# EAGLE design WC_Lower (EAGLE 9.6.2)
VERSION: 2.0

## Sheet 1 of 2: Power and B2B
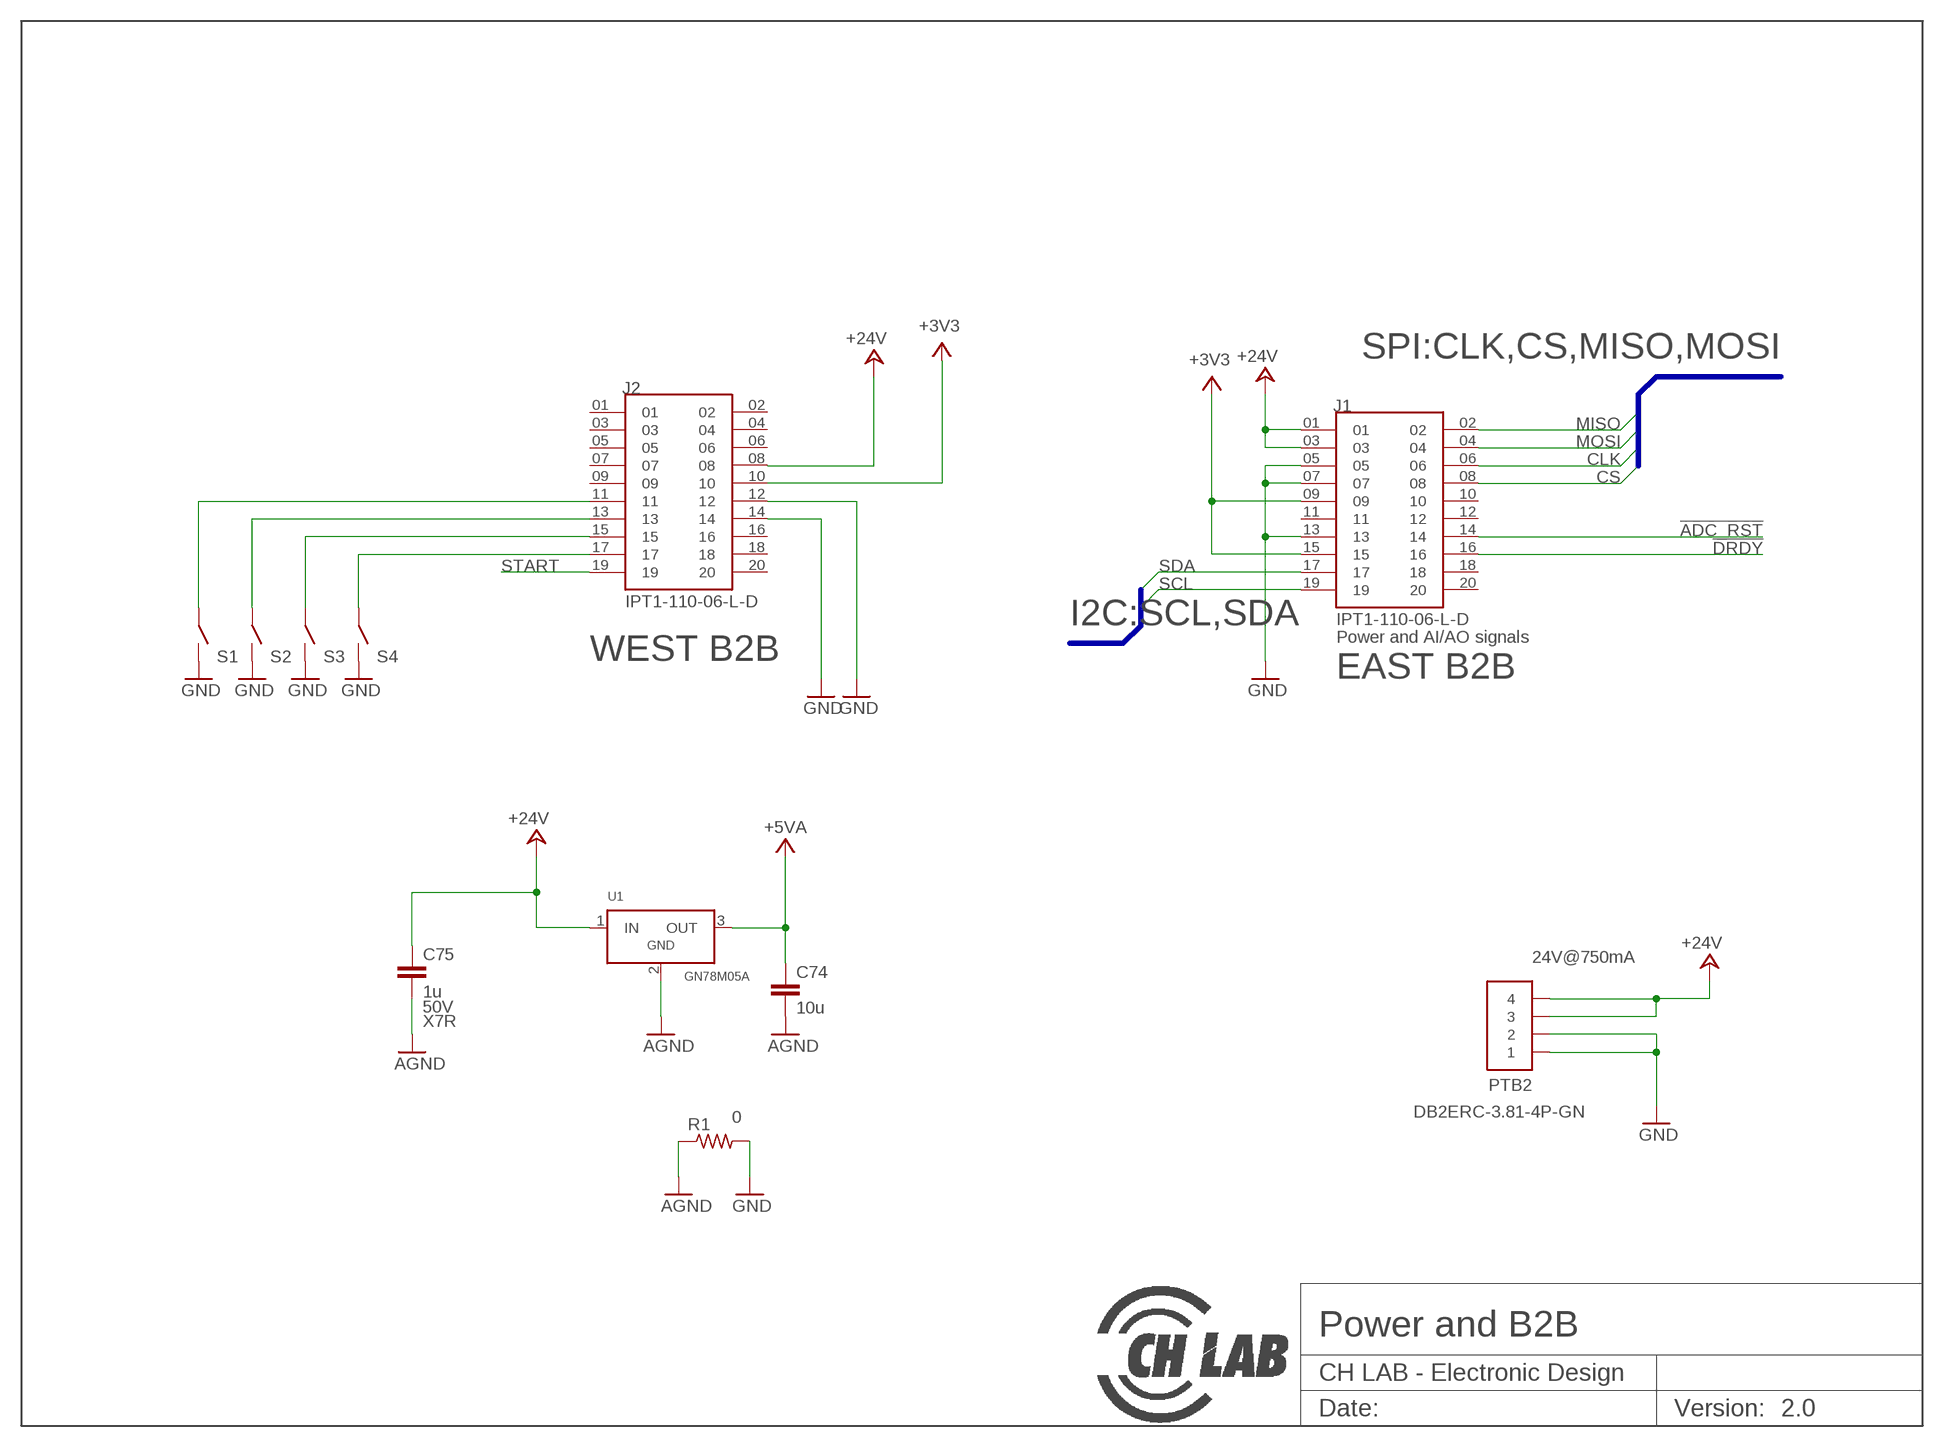
[diagram p0: schematic, sheet 1]

### Parts
C74  10u  C_0805  [C_0805]
C75  1u  C_1206  [C_1206]
J1  IPT1-110-06-L-D  [SAMTEC_IPT1-110-06-L-D]
J2  IPT1-110-06-L-D  [SAMTEC_IPT1-110-06-L-D]
PTB2  DB2ERC-3.81-4P-GN  PLUGTB-4-1803293  [1803293]
R1  0  R_0603  [R_0603]
S1  TSWITCH_SMTR2  [SMTR2]
S2  TSWITCH_SMTR2  [SMTR2]
S3  TSWITCH_SMTR2  [SMTR2]
S4  TSWITCH_SMTR2  [SMTR2]
U1  GN78M05A  [TO-252]

### Nets
!ADC_RST!: J1.14 ; also sheet 2
!DRDY!: J1.16 ; also sheet 2
+3V3: J1.09 J1.15 J2.10 ; also sheet 2
+5VA: C74.P$1 U1.3(OUT) ; also sheet 2
+24V: C75.P$1 J1.01 J1.03 J2.08 PTB2.P$3 PTB2.P$4 U1.1(IN)
AGND: C74.P$2 C75.P$2 R1.1 U1.2(GND) ; also sheet 2
CLK: J1.06 ; also sheet 2
CS: J1.08 ; also sheet 2
GND: J1.05 J1.07 J1.13 J2.12 J2.14 PTB2.P$1 PTB2.P$2 R1.2 S1.P$3 S1.P$4 S2.P$3 S2.P$4 S3.P$3 S3.P$4 S4.P$3 S4.P$4 ; also sheet 2
MISO: J1.02 ; also sheet 2
MOSI: J1.04 ; also sheet 2
N$1: J2.17 S4.P$1 S4.P$2
N$4: J2.15 S3.P$1 S3.P$2
N$8: J2.13 S2.P$1 S2.P$2
N$9: J2.11 S1.P$1 S1.P$2
SCL: J1.19
SDA: J1.17
START: J2.19 ; also sheet 2
Unconnected: J1.10 J1.11 J1.12 J1.18 J1.20 J2.01 J2.02 J2.03 J2.04 J2.05 J2.06 J2.07 J2.09 J2.16 J2.18 J2.20

### Buses
I2C:SCL,SDA
SPI:CLK,CS,MISO,MOSI

### Notes on the sheet
- Power and AI/AO signals
- WEST B2B
- EAST B2B
- 24V@750mA

## Sheet 2 of 2: ADC
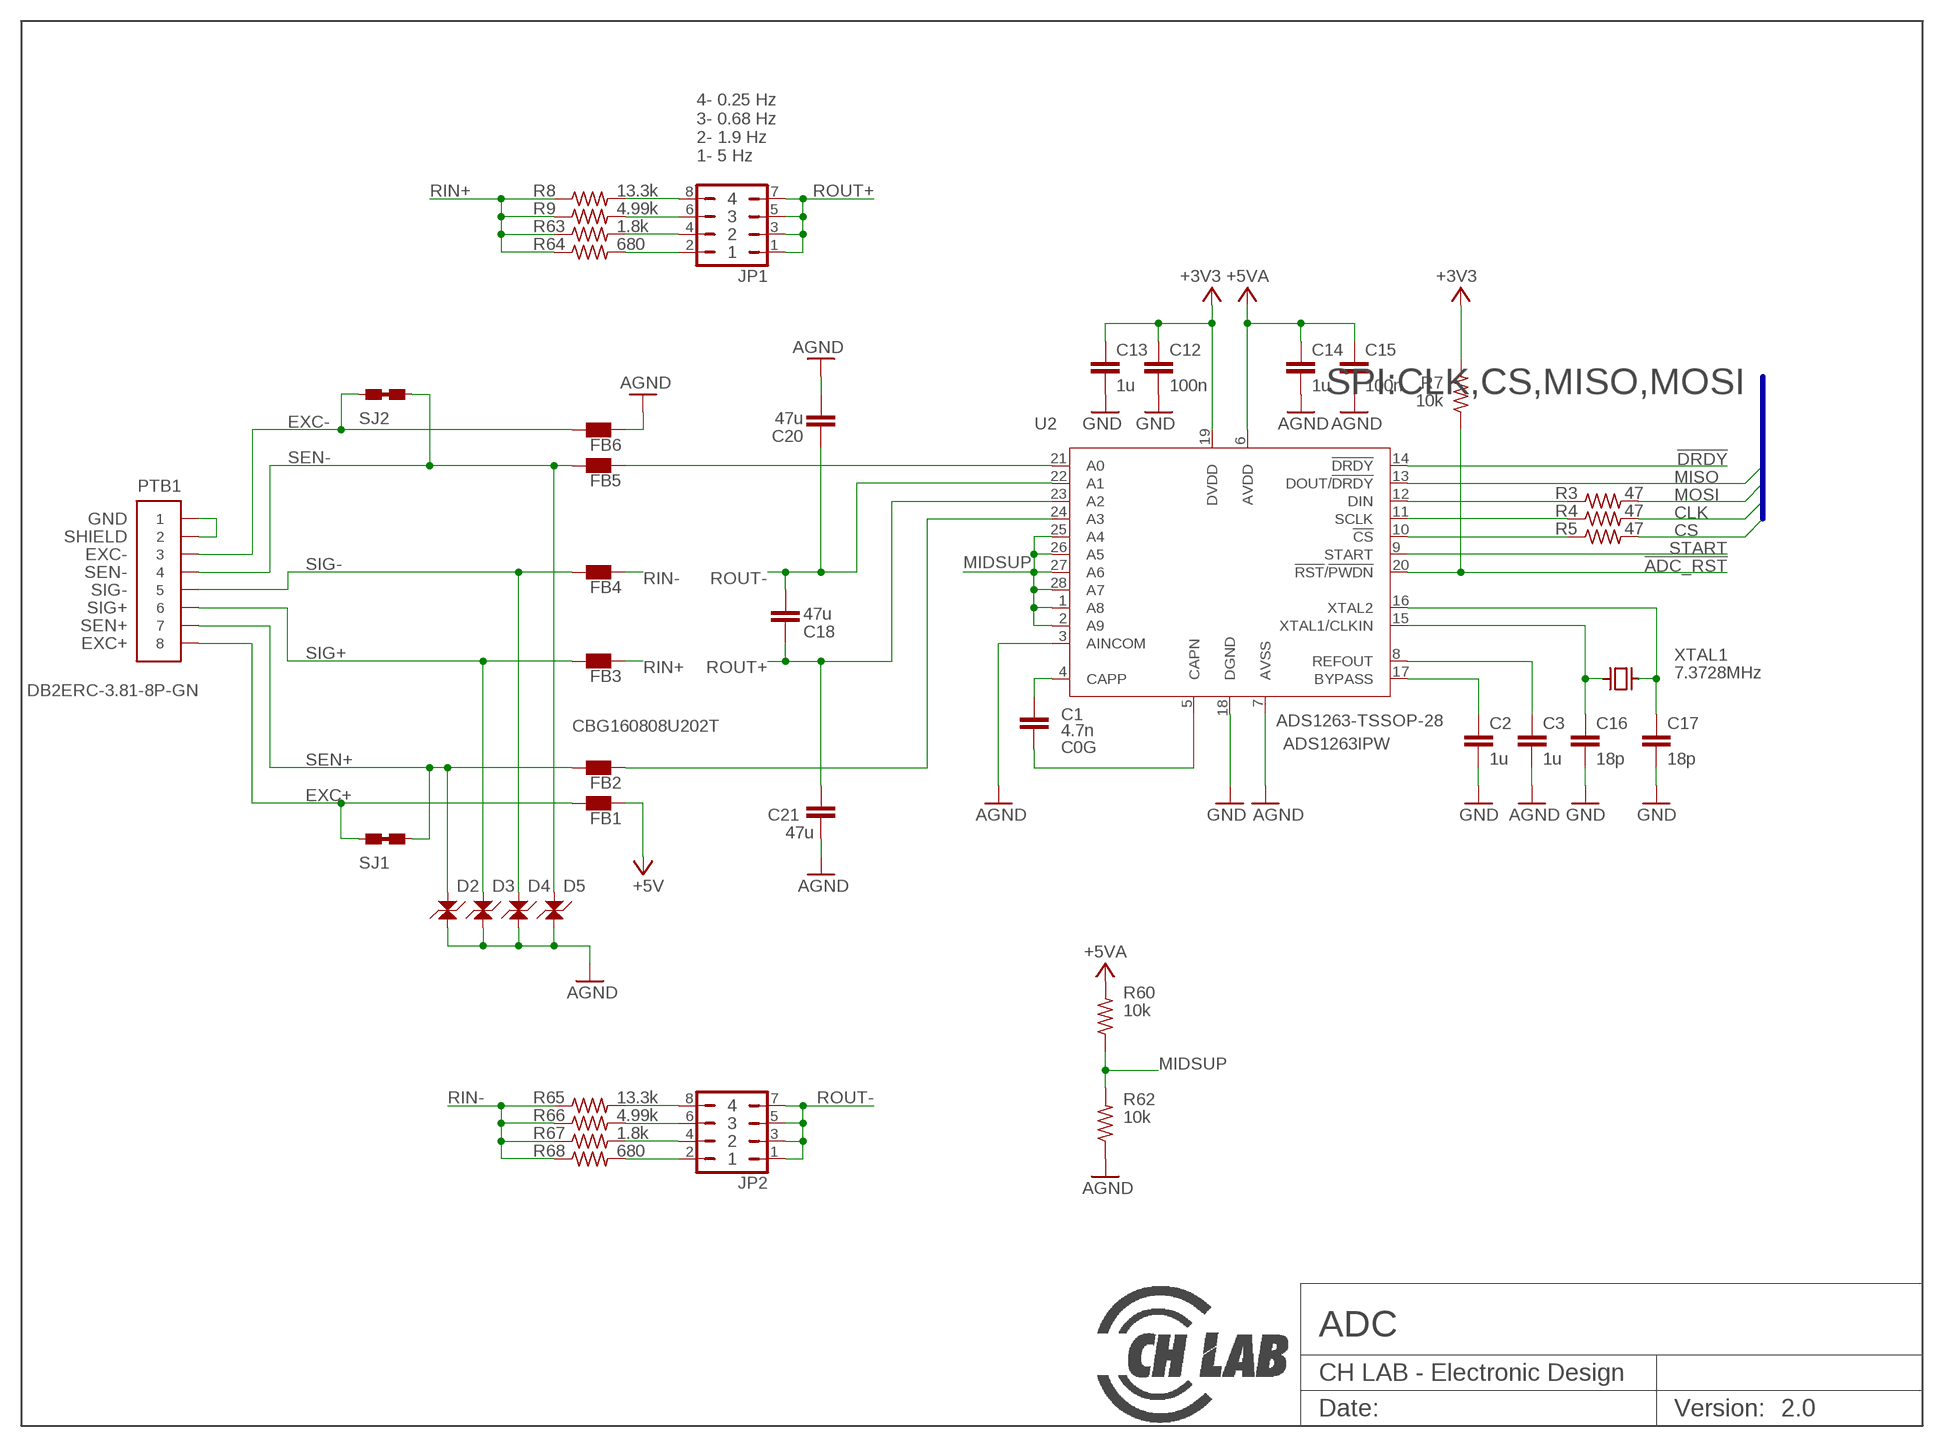
[diagram p1: schematic, sheet 2]

### Parts
C1  4.7n  C_0603  [C_0603]
C2  1u  C_0603  [C_0603]
C3  1u  C_0603  [C_0603]
C12  100n  C_0603  [C_0603]
C13  1u  C_0603  [C_0603]
C14  1u  C_0603  [C_0603]
C15  100n  C_0603  [C_0603]
C16  18p  C_0603  [C_0603]
C17  18p  C_0603  [C_0603]
C18  47u  C_1210  [C_1210]
C20  47u  C_1210  [C_1210]
C21  47u  C_1210  [C_1210]
D2  LESD5D5.0CT1G  [SOD523]
D3  LESD5D5.0CT1G  [SOD523]
D4  LESD5D5.0CT1G  [SOD523]
D5  LESD5D5.0CT1G  [SOD523]
FB1  FB_0603  [R_0603]
FB2  FB_0603  [R_0603]
FB3  FB_0603  [R_0603]
FB4  FB_0603  [R_0603]
FB5  FB_0603  [R_0603]
FB6  FB_0603  [R_0603]
JP1  CONVERT-2X4-2.54MALE  [CONN-VERT-2.54MM-2X4-MALE]
JP2  CONVERT-2X4-2.54MALE  [CONN-VERT-2.54MM-2X4-MALE]
PTB1  DB2ERC-3.81-8P-GN  PLUGTB-8-1803332  [1803332]
R3  47  R_0402  [R_0402]
R4  47  R_0402  [R_0402]
R5  47  R_0402  [R_0402]
R7  10k  R_0603  [R_0603]
R8  13.3k  R_0603  [R_0603]
R9  4.99k  R_0603  [R_0603]
R60  10k  R_0603  [R_0603]
R62  10k  R_0603  [R_0603]
R63  1.8k  R_0603  [R_0603]
R64  680  R_0603  [R_0603]
R65  13.3k  R_0603  [R_0603]
R66  4.99k  R_0603  [R_0603]
R67  1.8k  R_0603  [R_0603]
R68  680  R_0603  [R_0603]
SJ1  SJUMPER-NC  [SJ1]
SJ2  SJUMPER-NC  [SJ1]
U2  ADS1263-TSSOP-28  [SOP65P640X120-28N]
XTAL1  7.3728MHz  XTAL_11.4X4.7  [XTAL]

### Nets
!ADC_RST!: R7.1 U2.20(!RST!/!PWDN!) ; also sheet 1
!DRDY!: U2.14(!DRDY!) ; also sheet 1
+3V3: C12.P$1 C13.P$1 R7.2 U2.19(DVDD) ; also sheet 1
+5V: FB1.2
+5VA: C14.P$1 C15.P$1 R60.2 U2.6(AVDD) ; also sheet 1
AGND: C3.P$2 C14.P$2 C15.P$2 C20.P$1 C21.P$1 D2.C D3.C D4.C D5.C FB6.2 R62.1 U2.3(AINCOM) U2.7(AVSS) ; also sheet 1
CLK: R4.2 ; also sheet 1
CS: R5.2 ; also sheet 1
EXC+: FB1.1 PTB1.P$8 SJ1.P$1
EXC-: FB6.1 PTB1.P$3 SJ2.P$1
GND: C2.P$2 C12.P$2 C13.P$2 C16.P$2 C17.P$2 U2.18(DGND) ; also sheet 1
MIDSUP: R60.1 R62.2 U2.1(A8) U2.2(A9) U2.25(A4) U2.26(A5) U2.27(A6) U2.28(A7)
MISO: U2.13(DOUT/!DRDY!) ; also sheet 1
MOSI: R3.2 ; also sheet 1
N$2: C1.P$2 U2.5(CAPN)
N$3: C1.P$1 U2.4(CAPP)
N$5: C2.P$1 U2.17(BYPASS)
N$6: C3.P$1 U2.8(REFOUT)
N$7: C17.P$1 U2.16(XTAL2) XTAL1.2(X2)
N$10: R3.1 U2.12(DIN)
N$11: PTB1.P$1 PTB1.P$2
N$14: R4.1 U2.11(SCLK)
N$34: R5.1 U2.10(!CS!)
N$41: C16.P$1 U2.15(XTAL1/CLKIN) XTAL1.1(X1)
N$42: FB2.2 U2.24(A3)
N$43: JP1.8 R8.2
N$44: JP1.6 R9.2
N$45: JP1.4 R63.2
N$46: JP1.2 R64.2
N$47: FB5.2 U2.21(A0)
N$48: JP2.8 R65.2
N$49: JP2.6 R66.2
N$50: JP2.4 R67.2
N$51: JP2.2 R68.2
RIN+: FB3.2 R8.1 R9.1 R63.1 R64.1
RIN-: FB4.2 R65.1 R66.1 R67.1 R68.1
ROUT+: C18.P$1 C21.P$2 JP1.1 JP1.3 JP1.5 JP1.7 U2.23(A2)
ROUT-: C18.P$2 C20.P$2 JP2.1 JP2.3 JP2.5 JP2.7 U2.22(A1)
SEN+: D2.A FB2.1 PTB1.P$7 SJ1.P$2
SEN-: D5.A FB5.1 PTB1.P$4 SJ2.P$2
SIG+: D3.A FB3.1 PTB1.P$6
SIG-: D4.A FB4.1 PTB1.P$5
START: U2.9(START) ; also sheet 1

### Buses
SPI:CLK,CS,MISO,MOSI

### Notes on the sheet
- 4- 0.25 Hz
  3- 0.68 Hz
  2- 1.9 Hz
  1- 5 Hz
- 4
- 3
- 2
- 1
- GND
- SHIELD
- EXC-
- SEN-
- SIG-
- SIG+
- SEN+
- EXC+
- CBG160808U202T
- 4
- 3
- 2
- 1

## Library data of the parts
C1 = Property-standar:C; DK: C0G
C2 C3 C12-C18 C20 C21 C74 = Property-standar:C
C75 = Property-standar:C; D: X7R; ESR: LOW; V: 50V
D2-D5 = property:LESD5D5.0CT1G
FB1-FB6 = Property-standar:FB
J1 J2 = property-connectors:IPT1-110-06-L-D; MANUFACTURER: Samtec; PARTREV: R; STANDARD: Manufacturer Recommendations
JP1 JP2 = property-connectors:CONVERT-2X4-2.54MALE
PTB1 = property-connectors:PLUGTB-8; DESC: MC 1,5/ 8-G-3,81; MATING: 1803633
PTB2 = property-connectors:PLUGTB-4; DESC: MC 1,5/ 4-ST-3,81; MATING: 1803594
R1 R3-R5 R7-R9 R60 R62-R68 = Property-standar:R
S1-S4 = property:TSWITCH
SJ1 SJ2 = properti-mechanical:SJUMPER-NC
U1 = property-power:GN78M05A
U2 = property:ADS1263; MPN: ADS1263IPW
XTAL1 = property:XTAL; LINK: https://www.mouser.com/ProductDetail/ABRACON/ABLS-7.3728MHZ-K4T?qs=uDmhV2jwPReaiEAs5bxjfg%3D%3D; MPN: ABLS-7.3728MHZ-K4T

## Net classes
0 default: width 0.203 mm
1 dif_ETH: width 0.349 mm, clearance 0.508 mm to class 0, clearance 0.508 mm
2 MII: width 0.204 mm, clearance 0.508 mm to class 0, clearance 0.508 mm to class 1, clearance 0.203 mm

## Board
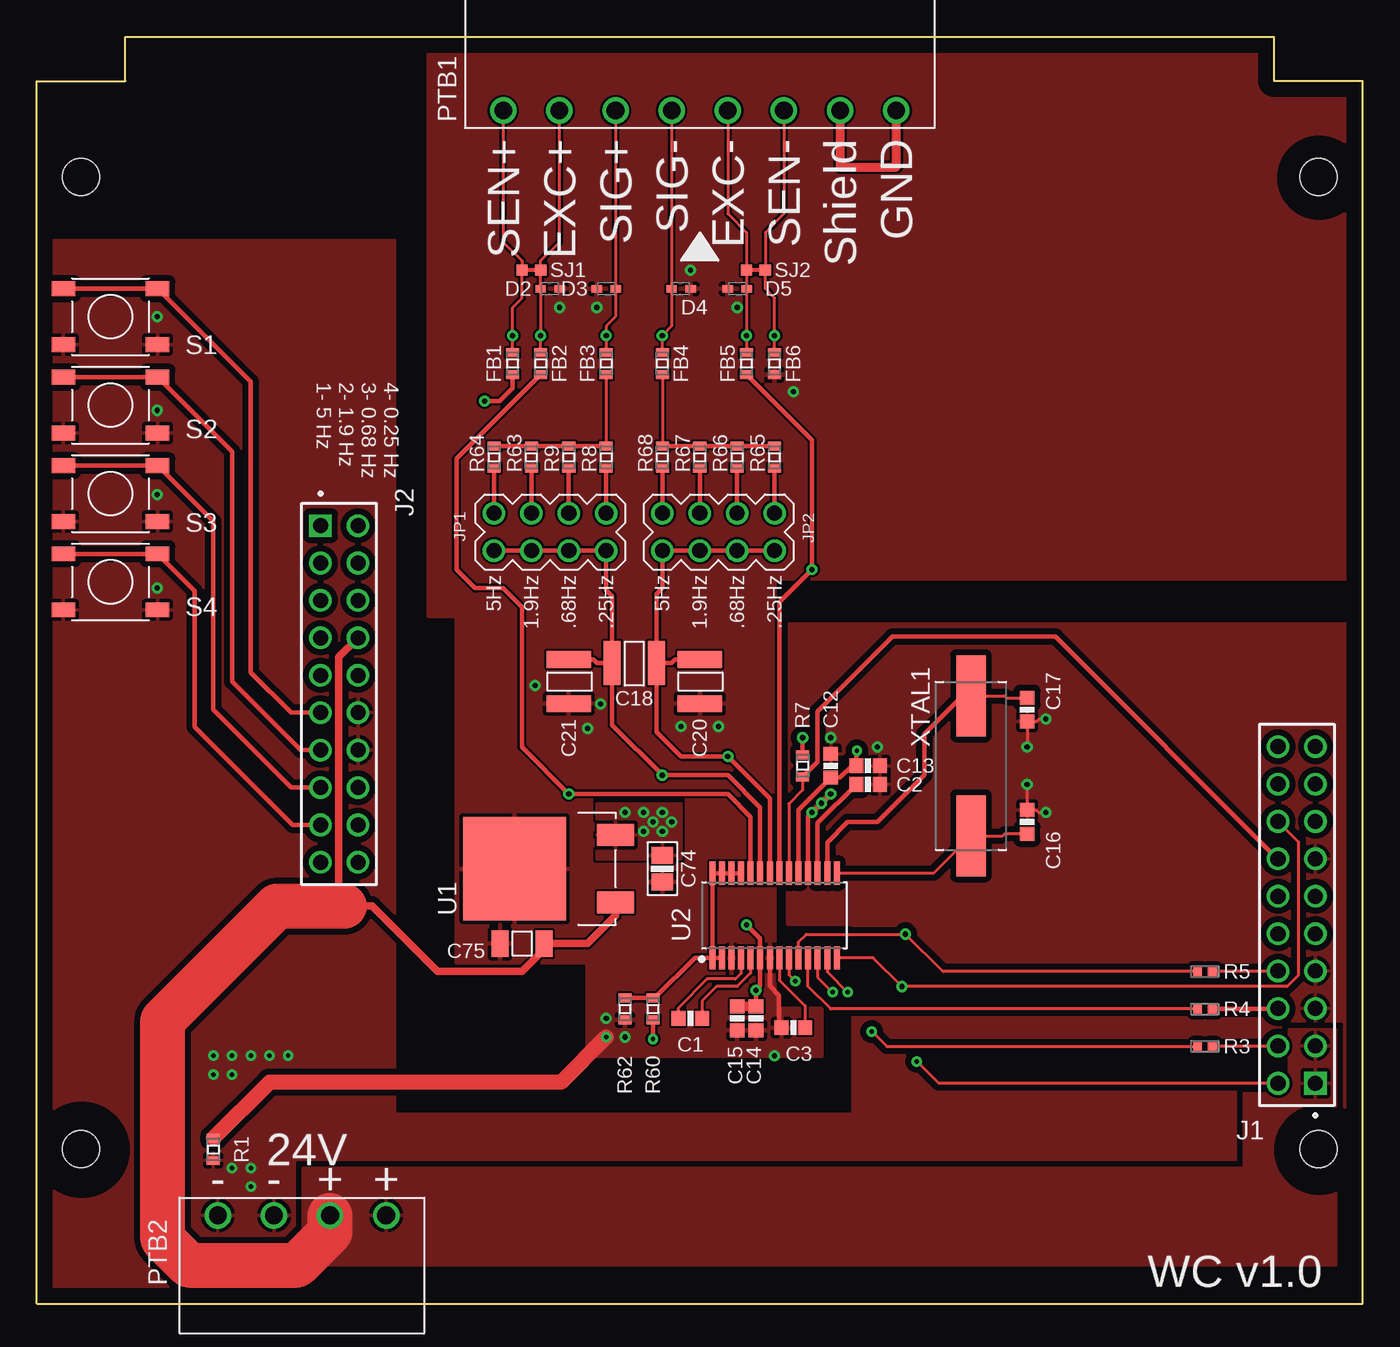
[diagram p2: board, top side]
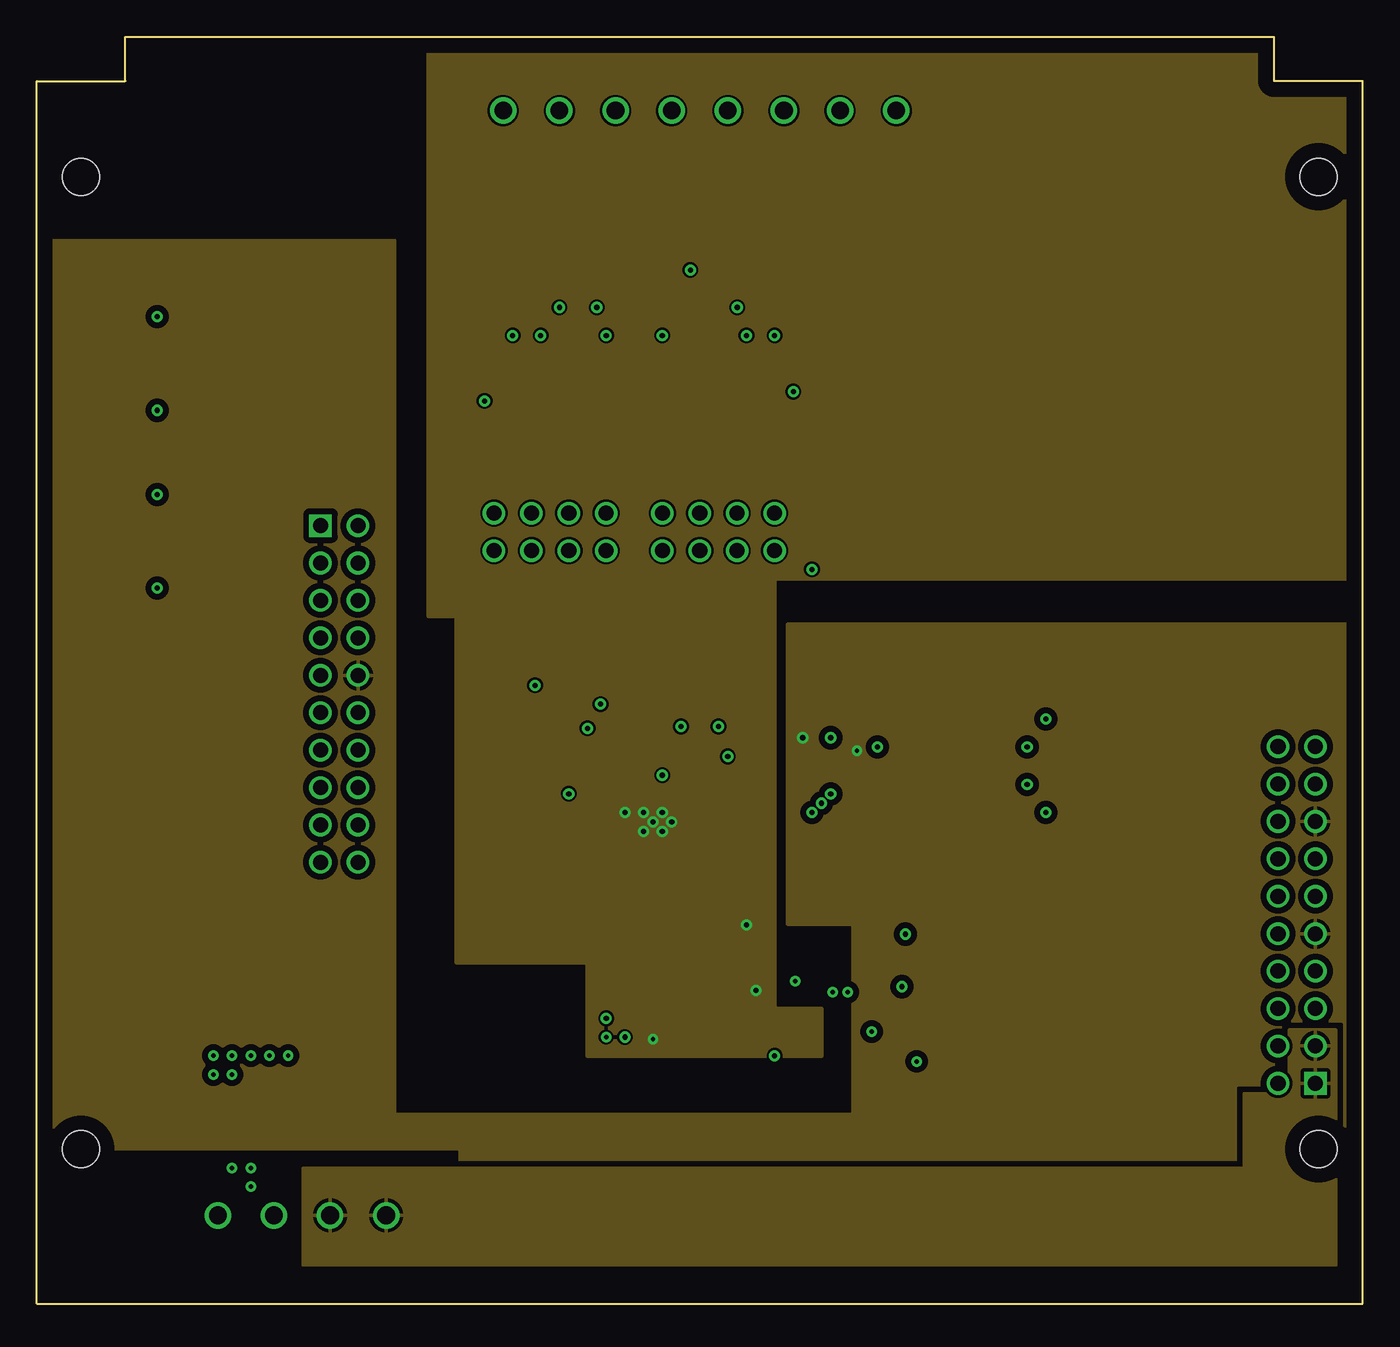
[diagram p3: board, inner layer Route2]
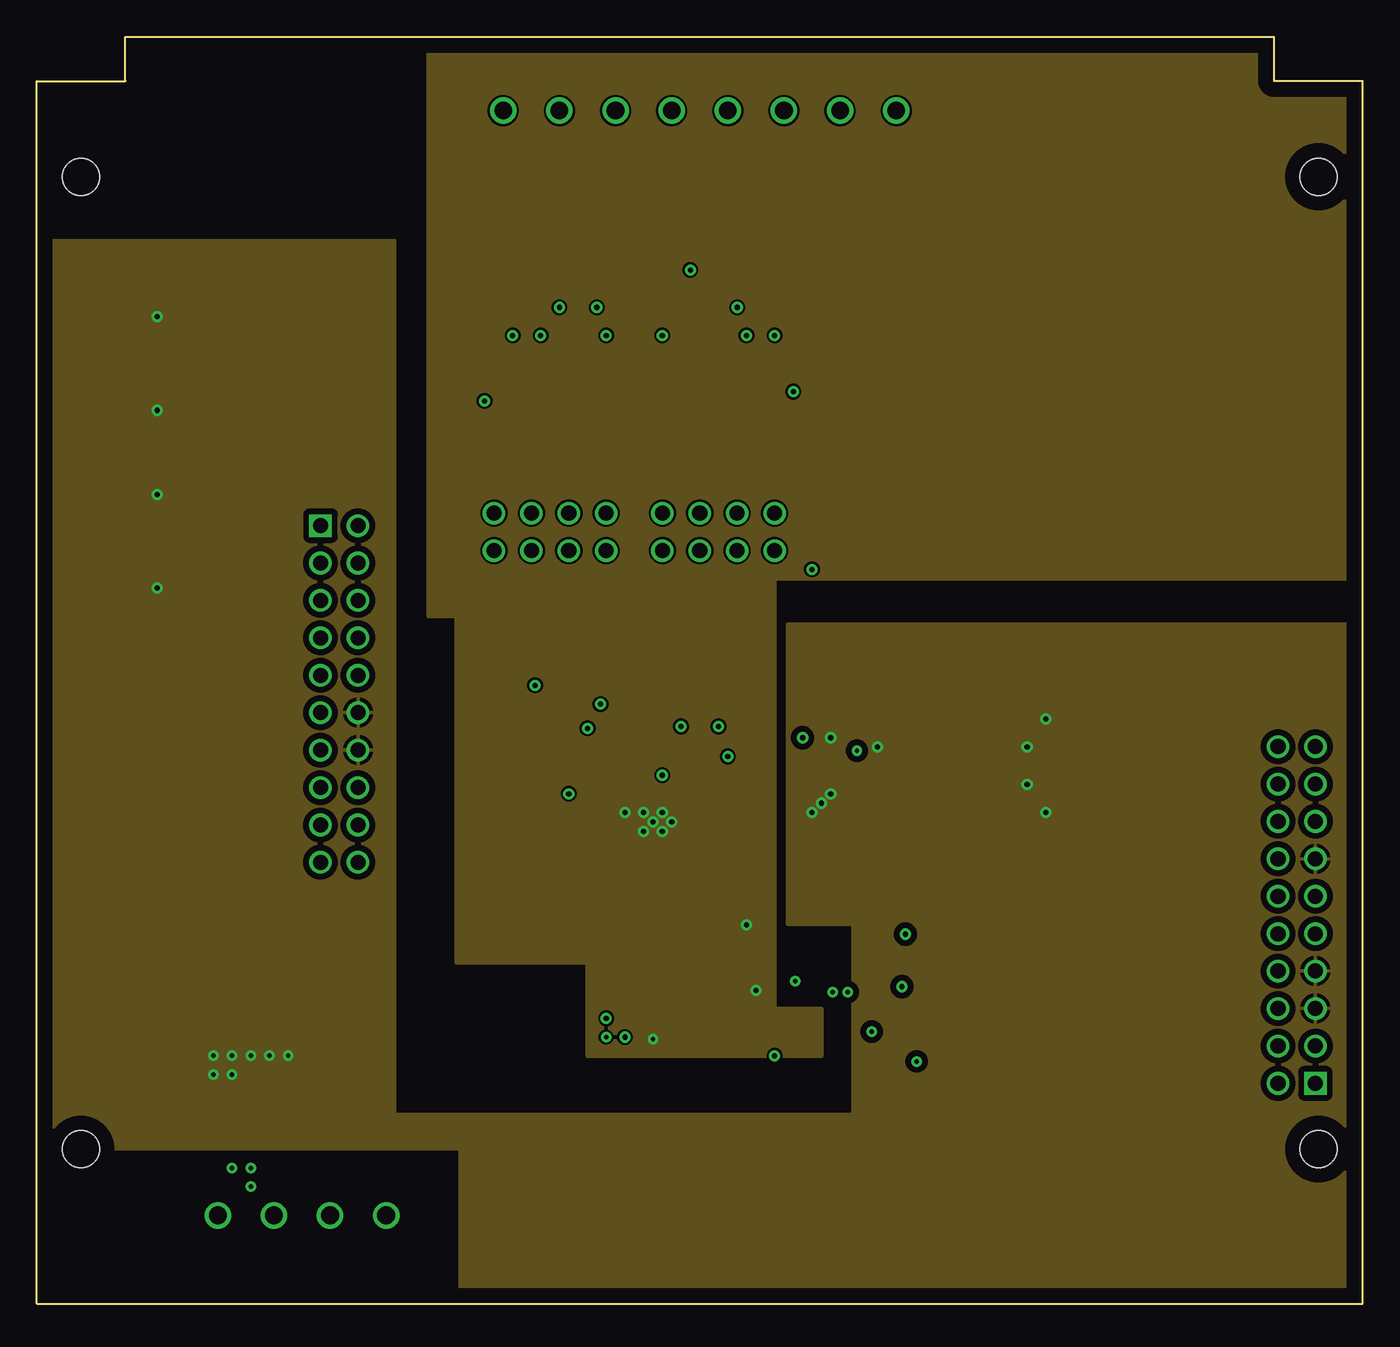
[diagram p4: board, inner layer Route15]
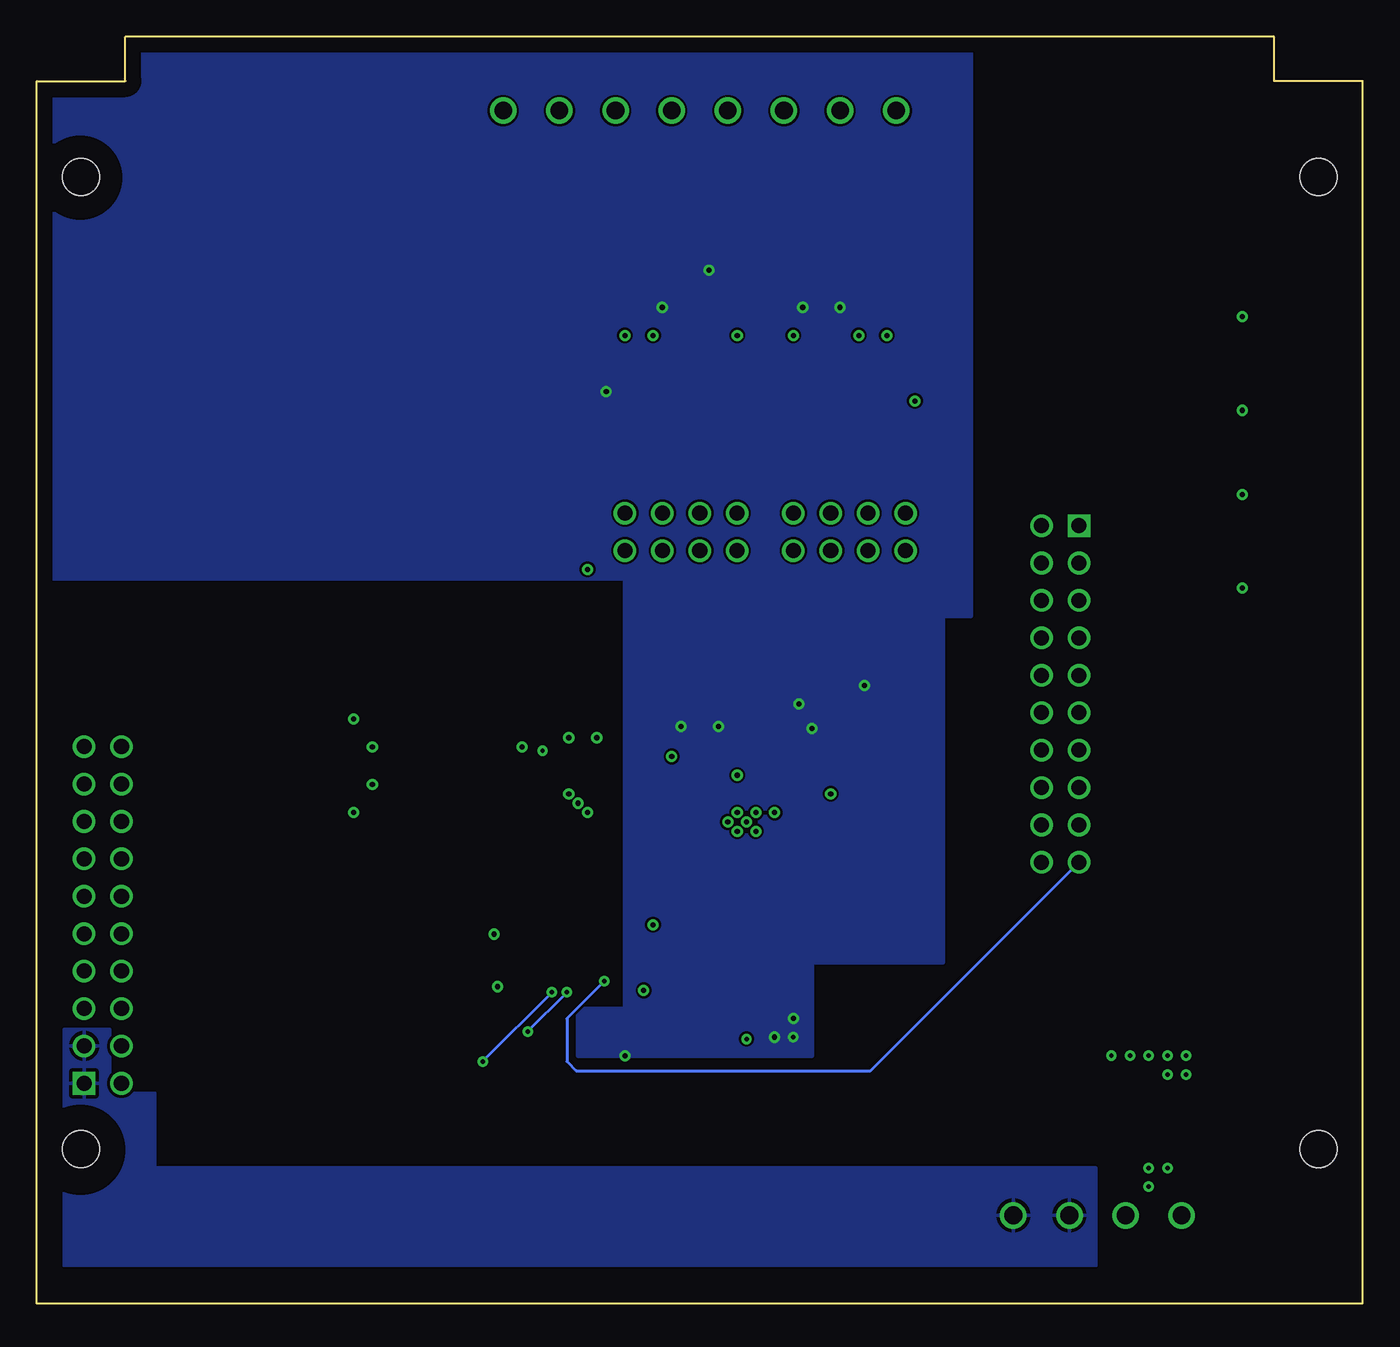
[diagram p5: board, bottom side, seen from below]

Size 90 x 86 mm. Coordinates in mm from the lower left corner, seen from the top.
Outline: 0,0 90,0 90,83 84,83 84,86 6,86 6,83 0,83 0,0
Copper layers (1+2*15+16): Top 0.035mm / dielectric 1.5mm / Route2 0.035mm / dielectric 0.15mm / Route15 0.035mm / dielectric 0.2mm / Bottom 0.035mm
Design rules "default *": minimum track width 6mil, minimum drill 0.3mm, track to track 6mil, track to pad 6mil, pad to pad 6mil, via to via 6mil, smd to smd 6mil, copper to edge 40mil, drill to drill 6mil, minimum pad ring 10mil, minimum via ring 8mil, stop-mask expansion 4mil, vias tented up to drill 100mm, thermal gap 10mil
Holes 2.5 mm at 3,76.5 87,76.5 3,10.5 87,10.5
tRestrict: area 0.3,7.7 to 5.8,13.2; area 84.3,73.7 to 89.8,79.2; area 84.3,7.7 to 89.8,13.2; area 0.3,73.7 to 5.8,79.2
bRestrict: area 0.3,7.7 to 5.8,13.2; area 84.3,73.7 to 89.8,79.2; area 84.3,7.7 to 89.8,13.2; area 0.3,73.7 to 5.8,79.2
vRestrict: area 0.3,7.7 to 5.8,13.2; area 84.3,73.7 to 89.8,79.2; area 84.3,7.7 to 89.8,13.2; area 0.3,73.7 to 5.8,79.2

### Footprints (pad centres in the part's own frame; a part is rotated, then mirrored left to right if it is on the bottom)
C_0603 = smd 0.95 x 1: P$1 -0.8,0; P$2 0.8,0
C_1210 = smd 1.15 x 3: P$1 -1.5,0; P$2 1.5,0
C_0805 = smd 1.15 x 1.45: P$1 -0.9,0; P$2 0.9,0
C_1206 = smd 1.15 x 1.8: P$1 -1.5,0; P$2 1.5,0
SOD523 = smd 0.7 x 0.5: A 0.65,0; C -0.65,0
R_0603 = smd 0.61 x 0.889: 1 -0.749,0; 2 0.749,0
SAMTEC_IPT1-110-06-L-D = drill 1.02 pad 1.37 square: 01 -11.43,-1.27 | drill 1.02 pad 1.37: 02 -11.43,1.27; 03 -8.89,-1.27; 04 -8.89,1.27; 05 -6.35,-1.27; 06 -6.35,1.27; 07 -3.81,-1.27; 08 -3.81,1.27; 09 -1.27,-1.27; 10 -1.27,1.27; 11 1.27,-1.27; 12 1.27,1.27; 13 3.81,-1.27; 14 3.81,1.27; 15 6.35,-1.27; 16 6.35,1.27; 17 8.89,-1.27; 18 8.89,1.27; 19 11.43,-1.27; 20 11.43,1.27
CONN-VERT-2.54MM-2X4-MALE = drill 1.02: 1 -3.81,-1.27; 2 -3.81,1.27; 3 -1.27,-1.27; 4 -1.27,1.27; 5 1.27,-1.27; 6 1.27,1.27; 7 3.81,-1.27; 8 3.81,1.27
1803332 = drill 1.2: P$1 -13.335,0; P$2 -9.525,0; P$3 -5.715,0; P$4 -1.905,0; P$5 1.905,0; P$6 5.715,0; P$7 9.525,0; P$8 13.335,0
1803293 = drill 1.2: P$1 -5.715,0; P$2 -1.905,0; P$3 1.905,0; P$4 5.715,0
R_0402 = smd 0.6 x 0.6: 1 -0.5,0; 2 0.5,0
SMTR2 = smd 1.6 x 1: P$1 -3.2,1.9; P$2 3.2,1.9; P$3 -3.2,-1.9; P$4 3.2,-1.9
SJ1 = smd 0.762 x 0.762: P$1 -0.635,0; P$2 0.635,0
TO-252 = smd 1.5 x 2.5: 1 -2.3,0; 3 2.3,0 | smd 7 x 7: 2 0,6.85
SOP65P640X120-28N = smd 0.407 x 1.572: 1 -4.225,-2.872; 2 -3.575,-2.872; 3 -2.925,-2.872; 4 -2.275,-2.872; 5 -1.625,-2.872; 6 -0.975,-2.872; 7 -0.325,-2.872; 8 0.325,-2.872; 9 0.975,-2.872; 10 1.625,-2.872; 11 2.275,-2.872; 12 2.925,-2.872; 13 3.575,-2.872; 14 4.225,-2.872; 15 4.225,2.872; 16 3.575,2.872; 17 2.925,2.872; 18 2.275,2.872; 19 1.625,2.872; 20 0.975,2.872; 21 0.325,2.872; 22 -0.325,2.872; 23 -0.975,2.872; 24 -1.625,2.872; 25 -2.275,2.872; 26 -2.925,2.872; 27 -3.575,2.872; 28 -4.225,2.872
XTAL = smd 5.5 x 2: 1 -4.75,0; 2 4.75,0

### Placement (x,y rotation side)
C1  44.37,19.37 0 top
C2  56.43,35.24 0 top
C3  51.35,18.73 180 top
C12  53.89,36.52 90 top
C13  56.43,36.52 0 top
C14  48.81,19.37 270 top
C15  47.54,19.37 270 top
C16  67.22,32.7 90 top
C17  67.22,40.33 270 top
C18  40.55,43.5 0 top
C20  45,42.23 90 top
C21  36.11,42.23 90 top
C74  42.46,29.53 270 top
C75  32.94,24.45 180 top
D2  34.84,68.9 180 top
D3  38.65,68.9 0 top
D4  43.73,68.9 180 top
D5  47.54,68.9 0 top
FB1  32.3,63.82 270 top
FB2  34.2,63.82 270 top
FB3  38.65,63.82 270 top
FB4  42.46,63.82 270 top
FB5  48.17,63.82 270 top
FB6  50.08,63.82 270 top
J1  85.53,26.39 90 top
J2  20.52,41.39 270 top
JP1  34.84,52.39 0 top
JP2  46.27,52.39 0 top
PTB1  45,81 180 top
PTB2  18,6 0 top
R1  11.98,10.48 270 top
R3  79.29,17.46 0 top
R4  79.29,20 0 top
R5  79.29,22.55 0 top
R7  51.98,36.52 90 top
R8  38.65,57.47 270 top
R9  36.11,57.47 270 top
R60  41.83,20 270 top
R62  39.92,20 90 top
R63  33.57,57.47 270 top
R64  31.03,57.47 270 top
R65  50.08,57.47 270 top
R66  47.54,57.47 270 top
R67  45,57.47 270 top
R68  42.46,57.47 270 top
S1  5,67 0 top
S2  5,61 0 top
S3  5,55 0 top
S4  5,49 0 top
SJ1  33.57,70.17 0 top
SJ2  48.81,70.17 180 top
U1  39.28,29.53 90 top
U2  50.08,26.36 0 top
XTAL1  63.41,36.52 90 top

### Tracks (layer width: path | path; a pad name or v marks a point on that pad's centre or on a via)
!ADC_RST!
  Top 0.203: R7.1 51.98,34.86 51.05,33.93 U2.20
  Top 0.305: R7.1 53,36.78 53,40.2 58.08,45.28 69.13,45.28 84.21,30.2 J1.14
!DRDY!  (via drill 0.35)
  Top 0.203: J1.16 85.64,31.36 85.64,22.29 84.88,21.53 v58.72,21.53 56.76,23.48 U2.14
+3V3  (via drill 0.3, 0.35)
  Top 0.305: U2.19 51.7,33.53 C12.P$1 54.52,35.72 55.33,36.52 C13.P$1 55.63,37.49 v55.67,37.53 | R7.2 v51.98,38.42
  pour Route2 (isolate 0.406, rank 3): -5.04,72.2 24.3,72.2 24.3,12.89 55.41,12.89 55.41,25.72 50.97,25.72 50.97,46.17 94.53,46.17 94.53,-4.51 28.74,-4.51 28.74,10.48 -5.04,10.48
+5V  (via drill 0.35)
  Top 0.305: FB1.2 32.3,62.17 31.41,61.28 v30.39,61.28
+5VA  (via drill 0.3, 0.35)
  Top 0.305: C14.P$1 v48.81,21.27 49.11,21.57 U2.6 49.11,24.79 v48.17,25.72 | R60.2 v41.83,17.97
  Top 0.635: C14.P$1 C15.P$1
  other vias: 41.83,32.7 43.09,32.7 42.46,33.34 42.46,32.07 41.19,33.34 39.92,33.34 41.19,32.07
  pour Top: 38.02,33.98 43.73,33.98 43.73,30.16 38.02,30.16
  pour Route2: 26.59,89.85 94.53,89.85 94.53,49.22 50.08,49.22 50.08,20 53.26,20 53.26,16.83 37.38,16.83 37.38,23.18 28.49,23.18 28.49,46.67 26.59,46.67
  pour Route15: 26.59,89.85 94.53,89.85 94.53,49.22 50.08,49.22 50.08,20 53.26,20 53.26,16.83 37.38,16.83 37.38,23.18 28.49,23.18 28.49,46.67 26.59,46.67
+24V
  Top 0.508: U1.1 39.28,26.36 37.38,24.45 C75.P$1 34.44,24.05 32.94,22.55 27.22,22.55 22.77,26.99 20.87,26.99 20.49,27.37 20.49,43.89 J2.08
  Top 3.048: PTB2.P$3 19.91,4.86 17.66,2.62 10.32,2.62 8.55,4.38 8.55,19.24 16.3,26.99 20.87,26.99
  pour Top (isolate 0.203): 85,18.61 88.18,18.61 88.18,2.61 18.08,2.61 18.08,9.21 81.96,9.21 81.96,14.29 85,14.29
  pour Route2 (isolate 0.203): 85,18.61 88.18,18.61 88.18,2.61 18.08,2.61 18.08,9.21 81.96,9.21 81.96,14.29 85,14.29
  pour Bottom (isolate 0.203): 85,18.61 88.18,18.61 88.18,2.61 18.08,2.61 18.08,9.21 81.96,9.21 81.96,14.29 85,14.29
AGND  (via drill 0.3, 0.35)
  Top 0.203: 50.39,18.89 C3.P$2
  Top 0.305: U2.7 49.76,21.58 50.39,20.94 50.39,18.89
  Top 1.016: R1.1 15.79,15.04 35.59,15.04 v38.65,18.1
  other vias: 38.65,19.37 39.92,18.1 50.08,16.83 37.38,39.05 38.27,40.71 33.82,41.98 46.27,39.18 47.54,67.63 35.48,67.63 43.73,39.18 51.35,61.91 38.02,67.63 44.37,70.17
  pour Top (rank 3): 26.59,89.85 94.53,89.85 94.53,49.22 50.08,49.22 50.08,20 53.26,20 53.26,16.83 37.38,16.83 37.38,23.18 28.49,23.18 28.49,46.67 26.59,46.67
  pour Bottom: 26.59,89.85 94.53,89.85 94.53,49.22 50.08,49.22 50.08,20 53.26,20 53.26,16.83 37.38,16.83 37.38,23.18 28.49,23.18 28.49,46.67 26.59,46.67
CLK
  Top 0.305: R4.2 84.22,20 J1.06
CS
  Top 0.203: R5.2 79.83,22.58 J1.08
EXC+  (via drill 0.35)
  Top 0.203: FB1.1 v32.3,65.72 32.3,67.63 32.94,68.27 SJ1.P$1 32.94,70.81 31.66,72.08 PTB1.P$8
EXC-  (via drill 0.35)
  Top 0.203: FB6.1 v50.08,65.72 50.08,68.27 49.45,68.9 SJ2.P$1 49.45,72.71 50.72,73.98 PTB1.P$3
GND  (via drill 0.3, 0.35)
  Top 0.203: v67.22,37.78 C17.P$2 67.86,39.52 68.03,39.69 v68.5,39.69 | v67.22,35.24 C16.P$2 67.82,33.51 67.99,33.34 v68.5,33.34
  Top 0.305: U2.18 52.36,33.08 v52.62,33.34 v53.26,33.98 v53.89,34.61
  other vias: 57.06,37.78 53.89,38.42 11.98,16.83 13.25,16.83 11.98,15.56 13.25,15.56 14.52,16.83 15.79,16.83 17.06,16.83 14.52,9.21 14.52,7.94 13.25,9.21 8.17,48.58 8.17,54.93 8.17,60.64 8.17,67
  pour Route15 (isolate 0.406): -5.04,72.2 24.3,72.2 24.3,12.89 55.41,12.89 55.41,25.72 50.97,25.72 50.97,46.17 94.53,46.17 94.53,-4.51 28.74,-4.51 28.74,10.48 -5.04,10.48
  pour Top (isolate 0.406, rank 3): -5.04,72.2 24.3,72.2 24.3,12.89 55.41,12.89 55.41,25.72 50.97,25.72 50.97,46.17 94.53,46.17 94.53,-4.51 -5.04,-4.51
MIDSUP
  Top 0.305: U2.2 U2.1 | U2.1 44.67,23.48 41.94,20.75 R60.1 R62.2 | U2.25 U2.26 U2.27 U2.28 U2.1
MISO  (via drill 0.3)
  Top 0.203: J1.02 61.22,14.96 v59.73,16.45 | U2.13 53.66,22.53 v55.03,21.15
  Bottom 0.203: v55.03,21.15 v59.73,16.45
MOSI
  Top 0.203: R3.2 79.83,17.5 J1.04
N$1
  Top 0.305: S4.P$1 S4.P$2 10.71,48.39 10.71,39.14 17.35,32.5 J2.17
N$2
  Top 0.203: U2.5 48.45,22.44 47.54,21.53 46.14,21.53 45.16,20.55 C1.P$2
N$3
  Top 0.203: U2.4 47.8,22.43 47.41,22.04 45.51,22.04 43.56,20.09 C1.P$1
N$4
  Top 0.305: J2.15 17.27,35.04 11.98,40.33 11.98,53.12 8.22,56.88 S3.P$2 S3.P$1
N$5
  Top 0.305: U2.17 53.01,32.62 C2.P$1
N$6
  Top 0.203: U2.8 50.41,21.97 52.15,20.22 C3.P$1
N$7
  Top 0.203: XTAL1.2 65.69,41.27 65.83,41.12 C17.P$1
  Top 0.305: U2.16 53.66,31.33 55.03,32.7 57.06,32.7 60.24,35.88 60.24,38.67 62.83,41.27 XTAL1.2
N$8
  Top 0.305: J2.13 17.9,37.58 13.25,42.23 13.25,57.85 S2.P$2 S2.P$1
N$9
  Top 0.305: J2.11 17.27,40.12 14.52,42.87 14.52,62.58 8.5,68.6 S1.P$2 S1.P$1
N$10  (via drill 0.3)
  Top 0.203: U2.12 53.01,22.16 v54.02,21.15 | v56.68,18.48 57.7,17.46 R3.1
  Bottom 0.203: v56.68,18.48 v54.02,21.15
N$11
  Top 0.61: PTB1.P$2 54.52,77.16 58.34,77.16 PTB1.P$1
N$14
  Top 0.203: R4.1 53.89,20 52.36,21.54 U2.11
N$34  (via drill 0.35)
  Top 0.203: R5.1 61.51,22.55 v58.97,25.09 52.24,25.09 51.7,24.55 U2.10
N$41
  Top 0.203: U2.15 60.88,29.23 XTAL1.1 65.57,31.77 65.71,31.91 C16.P$1
N$42  (via drill 0.35)
  Top 0.305: FB2.2 28.49,57.36 28.49,49.85 29.76,48.58 31.66,48.58 32.94,47.31 32.94,37.78 v36.11,34.61 46.91,34.61 48.45,33.06 U2.24
N$43
  Top 0.305: JP1.8 R8.2
N$44
  Top 0.305: R9.2 JP1.6
N$45
  Top 0.305: JP1.4 R63.2
N$46
  Top 0.305: R64.2 JP1.2
N$47  (via drill 0.35)
  Top 0.305: U2.21 50.41,47.63 v52.62,49.85 52.62,58.63 FB5.2
N$48
  Top 0.305: JP2.8 R65.2
N$49
  Top 0.305: JP2.6 R66.2
N$50
  Top 0.305: JP2.4 R67.2
N$51
  Top 0.305: JP2.2 R68.2
RIN+
  Top 0.203: FB3.2 R8.1
  Top 0.305: R8.1 R9.1 R63.1 R64.1
RIN-
  Top 0.203: FB4.2 R68.1
  Top 0.305: R65.1 R66.1 R67.1 R68.1
ROUT+  (via drill 0.35)
  Top 0.305: C21.P$2 37.78,43.73 38.02,43.5 C18.P$1 | C18.P$1 39.05,48.05 38.65,48.45 JP1.7 JP1.5 JP1.3 JP1.1 | C18.P$1 39.05,39.28 v42.46,35.88 46.91,35.88 49.11,33.68 U2.23
ROUT-  (via drill 0.35)
  Top 0.305: C20.P$2 43.33,43.73 43.09,43.5 C18.P$2 | C18.P$2 42.05,48.17 42.46,48.58 JP2.1 JP2.3 JP2.5 JP2.7 | C18.P$2 42.05,38.83 43.73,37.15 v46.91,37.15 49.76,34.3 U2.22
SEN+  (via drill 0.35)
  Top 0.203: FB2.1 v34.2,65.72 34.2,68.89 D2.A 34.19,69.92 34.2,69.94 SJ1.P$2 34.2,70.81 35.48,72.08 PTB1.P$7
SEN-  (via drill 0.35)
  Top 0.203: PTB1.P$4 46.91,73.98 48.17,72.71 SJ2.P$2 48.17,68.91 D5.A 48.17,68.89 v48.17,65.72 FB5.1
SIG+  (via drill 0.35)
  Top 0.203: PTB1.P$6 39.28,68.91 D3.A 39.3,67.01 38.65,66.36 v38.65,65.72 FB3.1
SIG-  (via drill 0.35)
  Top 0.203: PTB1.P$5 43.09,68.91 D4.A 43.08,66.34 v42.46,65.72 FB4.1
START  (via drill 0.3)
  Top 0.203: U2.9 51.05,22.33 v51.48,21.91
  Bottom 0.203: v51.48,21.91 54.02,19.37 54.02,16.45 53.38,15.81 33.4,15.81 J2.19

### Text on the board
tPlace: SEN+ | EXC+ | SIG+ | SIG- | EXC- | SEN- | Shield | GND | 4- 0.25 Hz / 3- 0.68 Hz / 2- 1.9 Hz / 1- 5 Hz | 5Hz | 1.9Hz | .68Hz | .25Hz | 5Hz | 1.9Hz | .68Hz | .25Hz | 24V | - | - | + | + | WC v1.0